# Altium schematic sheet [04] CM4_PART1.SchDoc: Compute Module 4 (Part #1)
size A3; Engineer: M. Folejewski; DocumentNumber: 4; SheetNumber: 4; SheetTotal: 17; PageSize: A3; Designators: 100-199
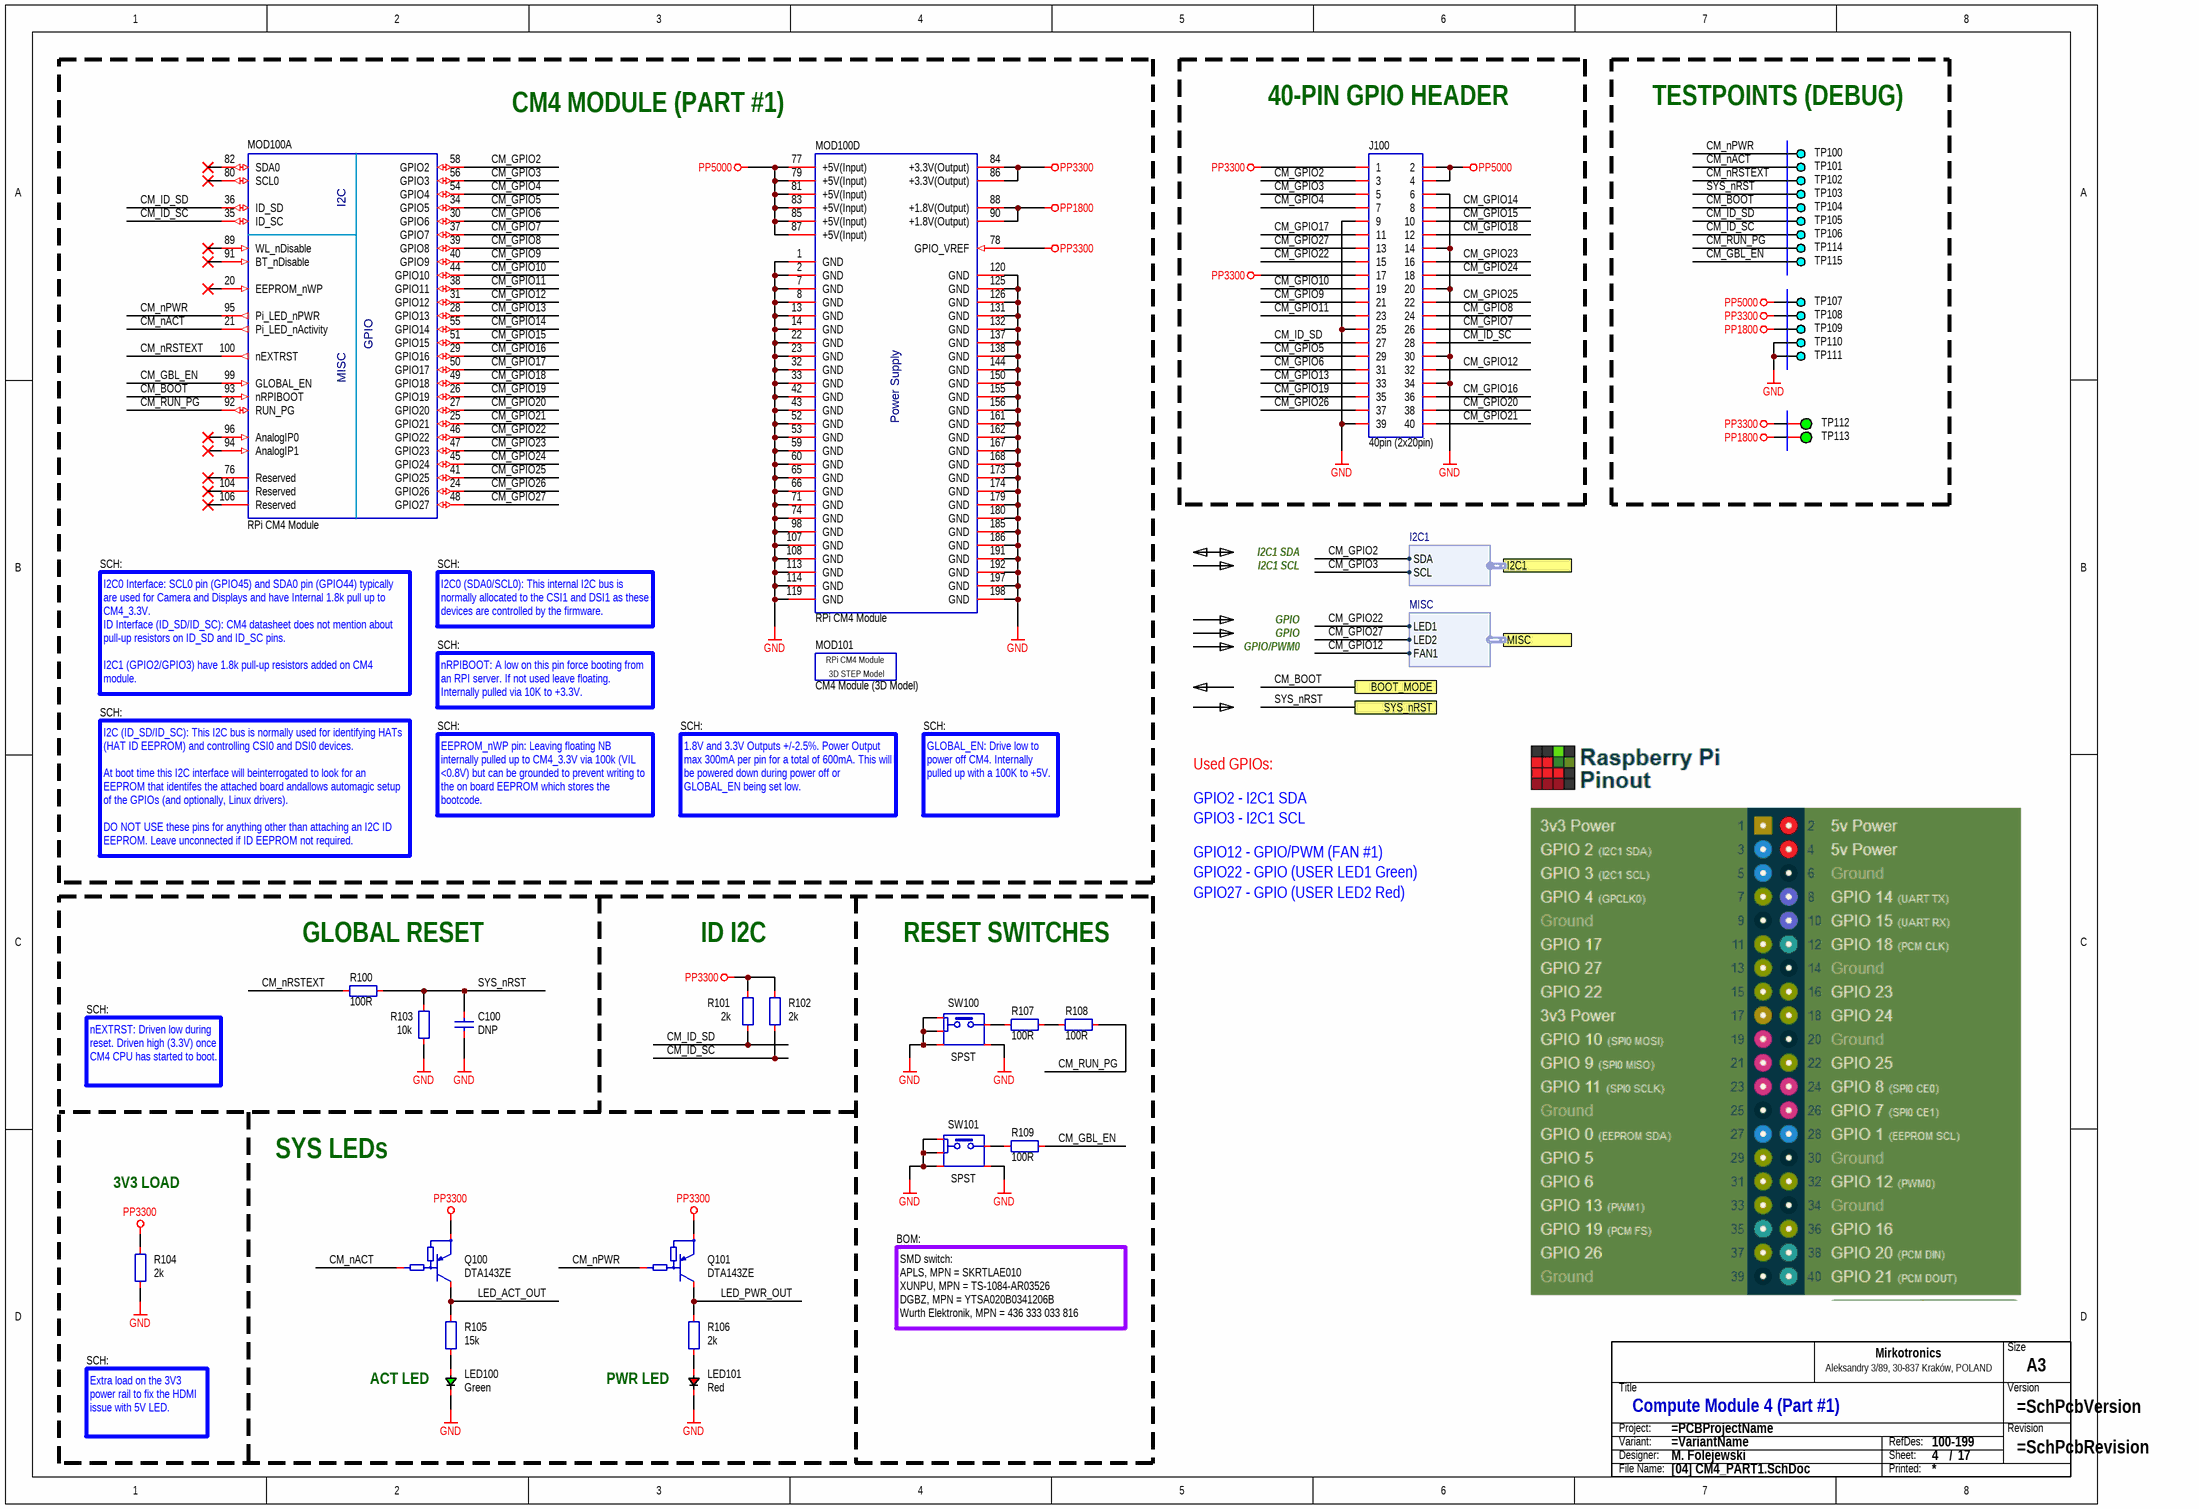
[diagram p0: [04] CM4_PART1.SchDoc]

## Parts
C100  DNP  [CAP_0603_R]
J100  40pin (2x20pin)  [CON_HDR_P254_2X20M_STR]
LED100  Green  [LED_0805_GRN_R]
LED101  Red  [LED_0805_RED_R]
MOD100  RPi CM4 Module  [MOD_RPI_CM4_SOCKET_P40_C300]  (parts A,D of 4)
MOD101  CM4 Module (3D Model)  [MOD_RPI_CM4_3D_C300_A1]  (no BOM)
Q100  DTA143ZE  [PKG_SOT523_SC75_SOT416_P100_R]
Q101  DTA143ZE  [PKG_SOT523_SC75_SOT416_P100_R]
R100  100R  [RES_0603_R]
R101  2k  [RES_0603_R]
R102  2k  [RES_0603_R]
R103  10k  [RES_0603_R]
R104  2k  [RES_0603_R]
R105  15k  [RES_0603_R]
R106  2k  [RES_0603_R]
R107  100R  [RES_0603_R]
R108  100R  [RES_0603_R]
R109  100R  [RES_0603_R]
SW100  SPST  [SWI_WRT_436333033816]
SW101  SPST  [SWI_WRT_436333033816]
TB?  Title block  (value not drawn)  (graphical)
TP100  DEBUG  [PCB_TP_DBG_50]  (value not drawn)  (no BOM)
TP101  DEBUG  [PCB_TP_DBG_50]  (value not drawn)  (no BOM)
TP102  DEBUG  [PCB_TP_DBG_50]  (value not drawn)  (no BOM)
TP103  DEBUG  [PCB_TP_DBG_50]  (value not drawn)  (no BOM)
TP104  DEBUG  [PCB_TP_DBG_50]  (value not drawn)  (no BOM)
TP105  DEBUG  [PCB_TP_DBG_50]  (value not drawn)  (no BOM)
TP106  DEBUG  [PCB_TP_DBG_50]  (value not drawn)  (no BOM)
TP107  DEBUG  [PCB_TP_DBG_50]  (value not drawn)  (no BOM)
TP108  DEBUG  [PCB_TP_DBG_50]  (value not drawn)  (no BOM)
TP109  DEBUG  [PCB_TP_DBG_50]  (value not drawn)  (no BOM)
TP110  DEBUG  [PCB_TP_DBG_50]  (value not drawn)  (no BOM)
TP111  DEBUG  [PCB_TP_DBG_50]  (value not drawn)  (no BOM)
TP112  ICT  [PCB_TP_ICT_100]  (value not drawn)  (no BOM)
TP113  ICT  [PCB_TP_ICT_100]  (value not drawn)  (no BOM)
TP114  DEBUG  [PCB_TP_DBG_50]  (value not drawn)  (no BOM)
TP115  DEBUG  [PCB_TP_DBG_50]  (value not drawn)  (no BOM)

## Ports
BOOT_MODE, I2C1 (harness I2C1), MISC (harness MISC), SYS_nRST

## Harnesses
MISC: LED1, LED2, FAN1
I2C1: SDA, SCL

## Nets
GND: C100.1 J100.6 J100.9 J100.14 J100.20 J100.25 J100.30 J100.34 J100.39 LED100.1 LED101.1 MOD100.1(GND) MOD100.2(GND) MOD100.7(GND) MOD100.8(GND) MOD100.13(GND) MOD100.14(GND) MOD100.22(GND) MOD100.23(GND) MOD100.32(GND) MOD100.33(GND) MOD100.42(GND) MOD100.43(GND) MOD100.52(GND) MOD100.53(GND) MOD100.59(GND) MOD100.60(GND) MOD100.65(GND) MOD100.66(GND) MOD100.71(GND) MOD100.74(GND) MOD100.98(GND) MOD100.107(GND) MOD100.108(GND) MOD100.113(GND) MOD100.114(GND) MOD100.119(GND) MOD100.120(GND) MOD100.125(GND) MOD100.126(GND) MOD100.131(GND) MOD100.132(GND) MOD100.137(GND) MOD100.138(GND) MOD100.144(GND) MOD100.150(GND) MOD100.155(GND) MOD100.156(GND) MOD100.161(GND) MOD100.162(GND) MOD100.167(GND) MOD100.168(GND) MOD100.173(GND) MOD100.174(GND) MOD100.179(GND) MOD100.180(GND) MOD100.185(GND) MOD100.186(GND) MOD100.191(GND) MOD100.192(GND) MOD100.197(GND) MOD100.198(GND) R103.1 R104.1 SW100.1 SW100.3 SW100.SH1 SW100.SH2 SW101.1 SW101.3 SW101.SH1 SW101.SH2 TP110.1 TP111.1
PP1800: MOD100.88(+1.8V(Output)) MOD100.90(+1.8V(Output)) TP109.1 TP113.1
PP3300: J100.1 J100.17 MOD100.78(GPIO_VREF) MOD100.84(+3.3V(Output)) MOD100.86(+3.3V(Output)) Q100.2(E) Q101.2(E) R101.2 R102.2 R104.2 TP108.1 TP112.1
PP5000: J100.2 J100.4 MOD100.77(+5V(Input)) MOD100.79(+5V(Input)) MOD100.81(+5V(Input)) MOD100.83(+5V(Input)) MOD100.85(+5V(Input)) MOD100.87(+5V(Input)) TP107.1
CM_BOOT: MOD100.93(nRPIBOOT) TP104.1 ; port BOOT_MODE
CM_GBL_EN: MOD100.99(GLOBAL_EN) R109.2 TP115.1
CM_GPIO2: J100.3 MOD100.58(GPIO2) ; port I2C1.SDA
CM_GPIO3: J100.5 MOD100.56(GPIO3) ; port I2C1.SCL
CM_GPIO4: J100.7 MOD100.54(GPIO4)
CM_GPIO5: J100.29 MOD100.34(GPIO5)
CM_GPIO6: J100.31 MOD100.30(GPIO6)
CM_GPIO7: J100.26 MOD100.37(GPIO7)
CM_GPIO8: J100.24 MOD100.39(GPIO8)
CM_GPIO9: J100.21 MOD100.40(GPIO9)
CM_GPIO10: J100.19 MOD100.44(GPIO10)
CM_GPIO11: J100.23 MOD100.38(GPIO11)
CM_GPIO12: J100.32 MOD100.31(GPIO12) ; port MISC.FAN1
CM_GPIO13: J100.33 MOD100.28(GPIO13)
CM_GPIO14: J100.8 MOD100.55(GPIO14)
CM_GPIO15: J100.10 MOD100.51(GPIO15)
CM_GPIO16: J100.36 MOD100.29(GPIO16)
CM_GPIO17: J100.11 MOD100.50(GPIO17)
CM_GPIO18: J100.12 MOD100.49(GPIO18)
CM_GPIO19: J100.35 MOD100.26(GPIO19)
CM_GPIO20: J100.38 MOD100.27(GPIO20)
CM_GPIO21: J100.40 MOD100.25(GPIO21)
CM_GPIO22: J100.15 MOD100.46(GPIO22) ; port MISC.LED1
CM_GPIO23: J100.16 MOD100.47(GPIO23)
CM_GPIO24: J100.18 MOD100.45(GPIO24)
CM_GPIO25: J100.22 MOD100.41(GPIO25)
CM_GPIO26: J100.37 MOD100.24(GPIO26)
CM_GPIO27: J100.13 MOD100.48(GPIO27) ; port MISC.LED2
CM_ID_SC: J100.28 MOD100.35(ID_SC) R102.1 TP106.1
CM_ID_SD: J100.27 MOD100.36(ID_SD) R101.1 TP105.1
CM_nACT: MOD100.21(Pi_LED_nActivity) Q100.1(B) TP101.1
CM_nPWR: MOD100.95(Pi_LED_nPWR) Q101.1(B) TP100.1
CM_nRSTEXT: MOD100.100(nEXTRST) R100.1 TP102.1
CM_RUN_PG: MOD100.92(RUN_PG) R108.2 TP114.1
LED_ACT_OUT: Q100.3(C) R105.2
LED_PWR_OUT: Q101.3(C) R106.2
SYS_nRST: C100.2 R100.2 R103.2 TP103.1 ; port SYS_nRST
NetLED100_2: LED100.2 R105.1
NetLED101_2: LED101.2 R106.1
NetR107_1: R107.1 SW100.2
NetR107_2: R107.2 R108.1
NetR109_1: R109.1 SW101.2

Not connected (* = marked no-connect by the designer): MOD100 20(EEPROM_nWP)* 76(Reserved)* 80(SCL0)* 82(SDA0)* 89(WL_nDisable)* 91(BT_nDisable)* 94(AnalogIP1)* 96(AnalogIP0)* 104(Reserved)* 106(Reserved)*

## Notes on the sheet
- 40-PIN GPIO HEADER
- TESTPOINTS (DEBUG)
- (near MOD100) CM4 MODULE (PART #1)
- SCH:
- I2C1 SDA
- I2C1 SCL
- I2C0 (SDA0/SCL0): This internal I2C bus is normally allocated to the CSI1 and DSI1 as these devices are controlled by the firmware.
- GPIO
- GPIO/PWM0
- I2C0 Interface: SCL0 pin (GPIO45) and SDA0 pin (GPIO44) typically are used for Camera and Displays and have Internal 1.8k pull up to CM4_3.3V.
  ID Interface (ID_SD/ID_SC): CM4 datasheet does not mention about pull-up resistors on ID_SD and ID_SC pins.
  I2C1 (GPIO2/GPIO3) have 1.8k pull-up resistors added on CM4 module.
- nRPIBOOT: A low on this pin force booting from an RPI server. If not used leave floating. Internally pulled via 10K to +3.3V.
- Used GPIOs:
- I2C (ID_SD/ID_SC): This I2C bus is normally used for identifying HATs (HAT ID EEPROM) and controlling CSI0 and DSI0 devices.
  At boot time this I2C interface will beinterrogated to look for an EEPROM that identifes the attached board andallows automagic setup of the GPIOs (and optionally, Linux drivers).
  DO NOT USE these pins for anything other than attaching an I2C ID EEPROM. Leave unconnected if ID EEPROM not required.
- EEPROM_nWP pin: Leaving floating NB internally pulled up to CM4_3.3V via 100k (VIL <0.8V) but can be grounded to prevent writing to the on board EEPROM which stores the bootcode.
- 1.8V and 3.3V Outputs +/-2.5%. Power Output max 300mA per pin for a total of 600mA. This will be powered down during power off or GLOBAL_EN being set low.
- GLOBAL_EN: Drive low to power off CM4. Internally pulled up with a 100K to +5V.
- GPIO2 - I2C1 SDA
- GPIO3 - I2C1 SCL
- GPIO12 - GPIO/PWM (FAN #1)
- GPIO22 - GPIO (USER LED1 Green)
- GPIO27 - GPIO (USER LED2 Red)
- GLOBAL RESET
- ID I2C
- RESET SWITCHES
- nEXTRST: Driven low during reset. Driven high (3.3V) once CM4 CPU has started to boot.
- 3V3 LOAD
- SYS LEDs
- BOM:
- SMD switch:
  APLS, MPN = SKRTLAE010
  XUNPU, MPN = TS-1084-AR03526
  DGBZ, MPN = YTSA020B0341206B
  Wurth Elektronik, MPN = 436 333 033 816
- ACT LED
- PWR LED
- Extra load on the 3V3 power rail to fix the HDMI issue with 5V LED.
- (in symbol MOD_CM4_3D_MODEL) RPi CM4 Module
- (in symbol MOD_RPI_CM4_VAR2, part A) I2C; GPIO; MISC
- (in symbol MOD_RPI_CM4_VAR2, part D) Power Supply
- (in symbol SCH_TITLE_BLOCK_MIRKOTRONICS_V2) Size; Mirkotronics; Aleksandry 3/89, 30-837 Kraków, POLAND; Title; Version; Project:; Revision; Variant:; RefDes:; Designer:; Sheet:; /; File Name:; Printed:

## Library data of the parts
C100 = CAP-0018: Capacitor; MLCC; DNP; TBD; TBD; TBD; DO NOT PLACE; SMD; 0603 (1608);; Component Type: Capacitor; Component Subtype: MLCC; Value: DNP; Manufacturer: DNP; MPN: DNP; Mounting Type: SMD; Package (Case): 0603 (1608); Supplier: ?; Supplier 1: LCSC
J100 = CON_2X20_ROW: Connector; 2 Row;; Manufacturer: GENERIC; Component Subtype: Pin Header; MPN: GENERIC; Value: 40pin (2x20pin); Component Type: Connector; Mounting Type: THT; Supplier: ?; Supplier 1: LCSC; Supplier Part Number 1: C124383
LED100 = DIO_LED_GRN: Diode; LED; Green;; Manufacturer: Foshan NationStar Optoelectronics; MPN: NCD0805G1; Component Subtype: LED Diode; Package (Case): 0805 (2012); Value: Green; Component Type: LED; Mounting Type: SMD; Supplier: LCSC; Supplier 1: LCSC; Supplier Part Number 1: C84260
LED101 = DIO_LED_RED: Diode; LED; Red;; Manufacturer: Foshan NationStar Optoelectronics; MPN: NCD0805R1; Component Subtype: LED Diode; Package (Case): 0805 (2012); Value: Red; Component Type: LED; Mounting Type: SMD; Supplier: LCSC; Supplier 1: LCSC; Supplier Part Number 1: C84256
MOD100 = MOD_RPI_CM4_VAR2: PCB Module; RPi Compute Module 4;; Manufacturer: Raspberry Pi Foundation; Component Subtype: Raspberry Pi CM4; MPN: CM4 Module; Value: RPi CM4 Module; Component Type: PCB Module; Mounting Type: -; Supplier: ?; Supplier 1: Farnell
MOD101 = MOD_CM4_3D_MODEL: PCB Module; RPi Compute Module 4; 3D model; Component Subtype: 3D STEP Model; Component Type: PCB Module; Manufacturer: -; Mounting Type: -; MPN: -; Package (Case): -; Supplier: -; Value: CM4 Module (3D Model)
Q100 Q101 = TRA_BJT_PNP_DIG_ONS_DTA143ZE: Transistor; BJT; PNP; Digital (Biased);; Manufacturer: On Semiconductor; MPN: DTA143ZET1G; Component Type: Transistor; Mounting Type: SMD; Value: DTA143ZE; Supplier 1: LCSC; Supplier Part Number 1: C600679
R100 R107-R109 = RES-0026: Resistor; Thick Film; 100R; 1%; 100mW; 100PPM; 75V; Standard; SMD; 0603 (1608);; Manufacturer: Yageo Corporation; MPN: TBD; Component Type: Resistor; Component Subtype: Thick Film; Value: 100R; Mounting Type: SMD; Package (Case): 0603 (1608); Supplier: ?; Supplier 1: LCSC; Supplier Part Number 1: C22775
R101 R102 R104 R106 = RES-0033: Resistor; Thick Film; 2k2; 1%; 100mW; 100PPM; 75V; Standard; SMD; 0603 (1608);; Manufacturer: Yageo Corporation; MPN: TBD; Component Type: Resistor; Component Subtype: Thick Film; Value: 2k; Mounting Type: SMD; Package (Case): 0603 (1608); Supplier: ?; Supplier 1: LCSC; Supplier Part Number 1: C22975
R103 = RES-0028: Resistor; Thick Film; 10k; 1%; 100mW; 100PPM; 75V; Standard; SMD; 0603 (1608);; Manufacturer: Yageo Corporation; MPN: RC0603FR-0710KL; Component Type: Resistor; Component Subtype: Thick Film; Value: 10k; Mounting Type: SMD; Package (Case): 0603 (1608); Supplier: ?; Supplier 1: LCSC; Supplier Part Number 1: C98220
R105 = RES-0043: Resistor; Thick Film; 15k; 1%; 100mW; 100PPM; 75V; Standard; SMD; 0603 (1608);; Manufacturer: Yageo Corporation; MPN: TBD; Component Type: Resistor; Component Subtype: Thick Film; Value: 15k; Mounting Type: SMD; Package (Case): 0603 (1608); Supplier: ?; Supplier 1: LCSC; Supplier Part Number 1: C22809
SW100 SW101 = SWI_TACT_3P_ABA_SH: Switch; Tactile; Monostable;; Manufacturer: Wurth Elektronik; MPN: 436 333 033 816; Package (Case): SMD; Specification: Tactile switch, WS-TASU series, 50mA/12VDC, 160g, SPST, 4.5x3.4mm, SMD package; Component Type: Switch; Mounting Type: SMD; Operating Temperature: -40°C to +85°C; Supplier 1: LCSC; Supplier Part Number 1: C110293; Value: SPST
TB? = SCH_TITLE_BLOCK_MIRKOTRONICS_V2: Component Type: Title block; Manufacturer: -; Mounting Type: Non component; MPN: -; Operating Temperature: -; Package: -; Specification: Title block; Value: Title block; Replacement: -; System: ?
TP100-TP111 TP114 TP115 = PCB_TP_DBG: PCB Marking; Test Point (Debug);; Value: DEBUG; Component Subtype: -; Component Type: Testpoint; Mounting Type: -; Supplier: ?
TP112 TP113 = PCB_TP_ICT: Test Point (ICT); Specification: Testpoint (for ICT), SMD pad; Component Type: Testpoint (for ICT); Manufacturer: -; Mounting Type: Non component; MPN: -; Value: ICT